# Altium schematic sheet 07_DDR3.SchDoc
size A3; Engineer: Mehmet Selcuk Yayan; Organization: Procenne
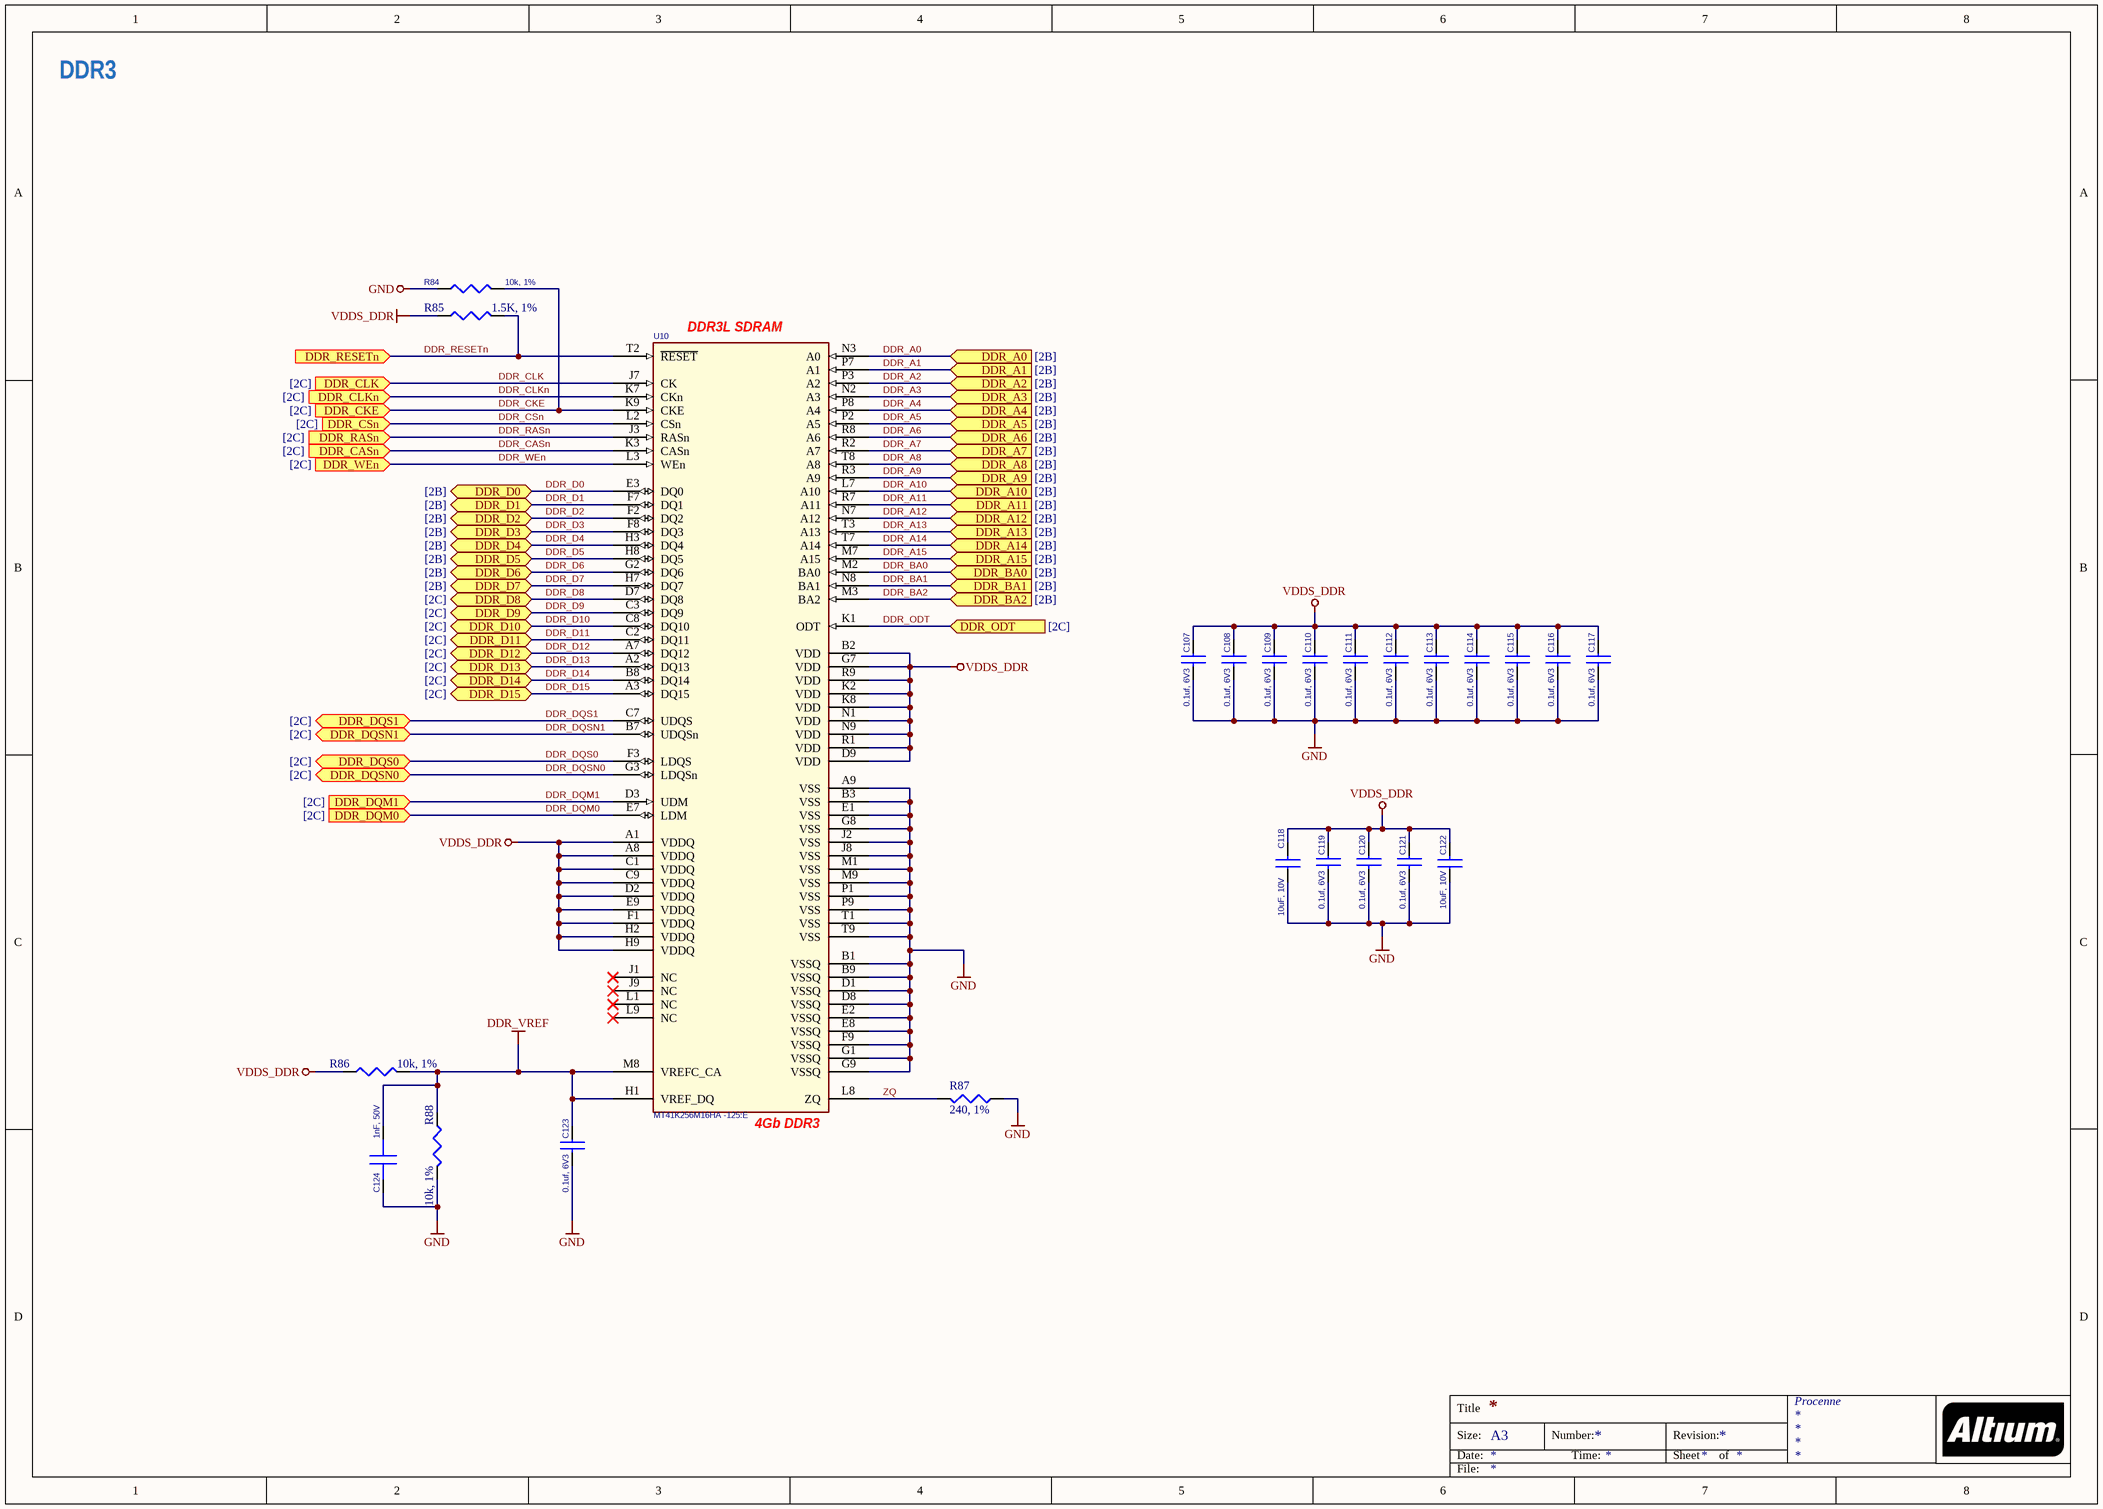
[diagram p0: 07_DDR3.SchDoc]

## Parts
C107  0.1uf, 6V3  [402]
C108  0.1uf, 6V3  [402]
C109  0.1uf, 6V3  [402]
C110  0.1uf, 6V3  [402]
C111  0.1uf, 6V3  [402]
C112  0.1uf, 6V3  [402]
C113  0.1uf, 6V3  [402]
C114  0.1uf, 6V3  [402]
C115  0.1uf, 6V3  [402]
C116  0.1uf, 6V3  [402]
C117  0.1uf, 6V3  [402]
C118  10uF, 10V  [805]
C119  0.1uf, 6V3  [402]
C120  0.1uf, 6V3  [402]
C121  0.1uf, 6V3  [402]
C122  10uF, 10V  [805]
C123  0.1uf, 6V3  [402]
C124  1nF, 50V  [402]
R84  10k, 1%  [402]
R85  1.5K, 1%  [402]
R86  10k, 1%  [402]
R87  240, 1%  [402]
R88  10k, 1%  [402]
U10  MT41K256M16HA -125:E  [BGA96_T9_P8_9X14]

## Ports
DDR_A0 (in, see [2B]), DDR_A1 (in, see [2B]), DDR_A2 (in, see [2B]), DDR_A3 (in, see [2B]), DDR_A4 (in, see [2B]), DDR_A5 (in, see [2B]), DDR_A6 (in, see [2B]), DDR_A7 (in, see [2B]), DDR_A8 (in, see [2B]), DDR_A9 (in, see [2B]), DDR_A10 (in, see [2B]), DDR_A11 (in, see [2B]), DDR_A12 (in, see [2B]), DDR_A13 (in, see [2B]), DDR_A14 (in, see [2B]), DDR_A15 (in, see [2B]), DDR_BA0 (in, see [2B]), DDR_BA1 (in, see [2B]), DDR_BA2 (in, see [2B]), DDR_CASn (in, see [2C]), DDR_CKE (in, see [2C]), DDR_CLK (in, see [2C]), DDR_CLKn (in, see [2C]), DDR_CSn (in, see [2C]), DDR_D0 (bidir, see [2B]), DDR_D1 (bidir, see [2B]), DDR_D2 (bidir, see [2B]), DDR_D3 (bidir, see [2B]), DDR_D4 (bidir, see [2B]), DDR_D5 (bidir, see [2B]), DDR_D6 (bidir, see [2B]), DDR_D7 (bidir, see [2B]), DDR_D8 (bidir, see [2C]), DDR_D9 (bidir, see [2C]), DDR_D10 (bidir, see [2C]), DDR_D11 (bidir, see [2C]), DDR_D12 (bidir, see [2C]), DDR_D13 (bidir, see [2C]), DDR_D14 (bidir, see [2C]), DDR_D15 (bidir, see [2C]), DDR_DQM0 (in, see [2C]), DDR_DQM1 (in, see [2C]), DDR_DQS0 (bidir, see [2C]), DDR_DQS1 (bidir, see [2C]), DDR_DQSN0 (bidir, see [2C]), DDR_DQSN1 (bidir, see [2C]), DDR_ODT (in, see [2C]), DDR_RASn (in, see [2C]), DDR_RESETn (in), DDR_WEn (in, see [2C])

## Nets
DDR_VREF: C123.1 C124.1 R86.2 R88.1 U10.H1(VREF_DQ) U10.M8(VREFC_CA)
GND: C107.2 C108.2 C109.2 C110.2 C111.2 C112.2 C113.2 C114.2 C115.2 C116.2 C117.2 C118.1 C119.2 C120.2 C121.2 C122.1 C123.2 C124.2 R84.1 R87.1 R88.2 U10.A9(VSS) U10.B1(VSSQ) U10.B3(VSS) U10.B9(VSSQ) U10.D1(VSSQ) U10.D8(VSSQ) U10.E1(VSS) U10.E2(VSSQ) U10.E8(VSSQ) U10.F9(VSSQ) U10.G1(VSSQ) U10.G8(VSS) U10.G9(VSSQ) U10.J2(VSS) U10.J8(VSS) U10.M1(VSS) U10.M9(VSS) U10.P1(VSS) U10.P9(VSS) U10.T1(VSS) U10.T9(VSS)
VDDS_DDR: C107.1 C108.1 C109.1 C110.1 C111.1 C112.1 C113.1 C114.1 C115.1 C116.1 C117.1 C118.2 C119.1 C120.1 C121.1 C122.2 R85.1 R86.1 U10.A1(VDDQ) U10.A8(VDDQ) U10.B2(VDD) U10.C1(VDDQ) U10.C9(VDDQ) U10.D2(VDDQ) U10.D9(VDD) U10.E9(VDDQ) U10.F1(VDDQ) U10.G7(VDD) U10.H2(VDDQ) U10.H9(VDDQ) U10.K2(VDD) U10.K8(VDD) U10.N1(VDD) U10.N9(VDD) U10.R1(VDD) U10.R9(VDD)
DDR_A0: U10.N3(A0) ; port DDR_A0
DDR_A1: U10.P7(A1) ; port DDR_A1
DDR_A2: U10.P3(A2) ; port DDR_A2
DDR_A3: U10.N2(A3) ; port DDR_A3
DDR_A4: U10.P8(A4) ; port DDR_A4
DDR_A5: U10.P2(A5) ; port DDR_A5
DDR_A6: U10.R8(A6) ; port DDR_A6
DDR_A7: U10.R2(A7) ; port DDR_A7
DDR_A8: U10.T8(A8) ; port DDR_A8
DDR_A9: U10.R3(A9) ; port DDR_A9
DDR_A10: U10.L7(A10) ; port DDR_A10
DDR_A11: U10.R7(A11) ; port DDR_A11
DDR_A12: U10.N7(A12) ; port DDR_A12
DDR_A13: U10.T3(A13) ; port DDR_A13
DDR_A14: U10.T7(A14) ; port DDR_A14
DDR_A15: U10.M7(A15) ; port DDR_A15
DDR_BA0: U10.M2(BA0) ; port DDR_BA0
DDR_BA1: U10.N8(BA1) ; port DDR_BA1
DDR_BA2: U10.M3(BA2) ; port DDR_BA2
DDR_CASn: U10.K3(CASn) ; port DDR_CASn
DDR_CKE: R84.2 U10.K9(CKE) ; port DDR_CKE
DDR_CLK: U10.J7(CK) ; port DDR_CLK
DDR_CLKn: U10.K7(CKn) ; port DDR_CLKn
DDR_CSn: U10.L2(CSn) ; port DDR_CSn
DDR_D0: U10.E3(DQ0) ; port DDR_D0
DDR_D1: U10.F7(DQ1) ; port DDR_D1
DDR_D2: U10.F2(DQ2) ; port DDR_D2
DDR_D3: U10.F8(DQ3) ; port DDR_D3
DDR_D4: U10.H3(DQ4) ; port DDR_D4
DDR_D5: U10.H8(DQ5) ; port DDR_D5
DDR_D6: U10.G2(DQ6) ; port DDR_D6
DDR_D7: U10.H7(DQ7) ; port DDR_D7
DDR_D8: U10.D7(DQ8) ; port DDR_D8
DDR_D9: U10.C3(DQ9) ; port DDR_D9
DDR_D10: U10.C8(DQ10) ; port DDR_D10
DDR_D11: U10.C2(DQ11) ; port DDR_D11
DDR_D12: U10.A7(DQ12) ; port DDR_D12
DDR_D13: U10.A2(DQ13) ; port DDR_D13
DDR_D14: U10.B8(DQ14) ; port DDR_D14
DDR_D15: U10.A3(DQ15) ; port DDR_D15
DDR_DQM0: U10.E7(LDM) ; port DDR_DQM0
DDR_DQM1: U10.D3(UDM) ; port DDR_DQM1
DDR_DQS0: U10.F3(LDQS) ; port DDR_DQS0
DDR_DQS1: U10.C7(UDQS) ; port DDR_DQS1
DDR_DQSN0: U10.G3(LDQSn) ; port DDR_DQSN0
DDR_DQSN1: U10.B7(UDQSn) ; port DDR_DQSN1
DDR_ODT: U10.K1(ODT) ; port DDR_ODT
DDR_RASn: U10.J3(RASn) ; port DDR_RASn
DDR_RESETn: R85.2 U10.T2(~{RESET}) ; port DDR_RESETn
DDR_WEn: U10.L3(WEn) ; port DDR_WEn
ZQ: R87.2 U10.L8(ZQ)

Not connected (* = marked no-connect by the designer): U10 J1(NC)* J9(NC)* L1(NC)* L9(NC)*

## Notes on the sheet
- DDR3
- (near U10) DDR3L SDRAM
- (near U10) 4Gb DDR3
- Title
- Size:
- Date:
- A3
- Number:
- Time:
- Revision:
- Sheet
- of
- File:

## Library data of the parts
C107-C117 C119-C121 C123 = CAP_0.01uf_X7R_16V_10%_0402: CAP CER 0.1UF 6.3V 10% X5R 0402; Manufacturer: TDK Corporation; Manufacturer Part Number: C1005X5R0J104K050BA; Capacitance: 0.1µF; Supplier 1: Digi-Key; Supplier Part Number 1: 445-1266-6-ND; RoHS: RoHS Compliant; Category: Capacitors; Stock 1: 127604; Pricing 1: 1=0.1, 10=0.026, 100=0.0121, 250=0.00992, 500=0.00848, 1000=0.0066, 5000=0.0055 (USD); Voltage - Rated: 6.3V; Tolerance: ±10%; Temperature Coefficient: X5R; Mounting Type: Surface Mount, MLCC; Operating Temperature: -55°C ~ 85°C; Applications: General Purpose; Ratings: -; Package / Case: 0402 (1005 Metric); Size / Dimension: 0.039" L x 0.020" W (1.00mm x 0.50mm); Height - Seated (Max): -; Thickness (Max): 0.022" (0.55mm); Lead Spacing: -; Features: -; Packaging: Digi-Reel®; Lead Style: -; ComponentLink1URL: http://www.kemet.com/datasheets&C0402C104K4RACTU; ComponentLink1Description: http://www.kemet.com/datasheets&C0402C104K4RACTU
C118 C122 = CAP_4.7uF_X5R_6.3V_10%_0603: CAP CER 10UF 10V Y5V 0805; Manufacturer: TDK Corporation; Manufacturer Part Number: C2012Y5V1A106Z; Capacitance: 10µF; Tolerance: -20%, +80%; Temperature Coefficient: Y5V (F); Supplier 1: Digi-Key; Supplier Part Number 1: 445-1371-6-ND; RoHS: RoHS Compliant; Category: Capacitors; Stock 1: 102071; Pricing 1: 1=0.15, 10=0.105, 100=0.0499, 250=0.042, 500=0.03518, 1000=0.02887 (USD); Voltage - Rated: 10V; Mounting Type: Surface Mount, MLCC; Operating Temperature: -30°C ~ 85°C; Applications: General Purpose; Ratings: -; Package / Case: 0805 (2012 Metric); Size / Dimension: 0.079" L x 0.049" W (2.00mm x 1.25mm); Height - Seated (Max): -; Thickness (Max): 0.057" (1.45mm); Lead Spacing: -; Features: -; Packaging: Digi-Reel®; Lead Style: -; ComponentLink1URL: http://media.digikey.com/pdf/Data%20Sheets/TDK%20PDFs/C_Series_GeneralAppl_B11.pdf; ComponentLink1Description: http://media.digikey.com/pdf/Data%20Sheets/TDK%20PDFs/C_Series_GeneralAppl_B11.pdf
C124 = CAP SMD: CAP CER 1000PF 16V 10% X7R 0402; Manufacturer: Yageo; Manufacturer Part Number: CC0402KRX7R7BB102; Supplier 1: Digi-Key; Supplier Part Number 1: 311-1352-6-ND; RoHS: RoHS Compliant; Category: Capacitors; Stock 1: 391222; Pricing 1: 1=0.1, 10=0.012, 25=0.0088, 100=0.0057, 250=0.00464, 500=0.00396, 1000=0.00309, 2500=0.00278, 5000=0.00258 (USD); Capacitance: 1000pF; Voltage - Rated: 16V; Tolerance: ±10%; Temperature Coefficient: X7R; Mounting Type: Surface Mount, MLCC; Operating Temperature: -55°C ~ 125°C; Applications: General Purpose; Ratings: -; Package / Case: 0402 (1005 Metric); Size / Dimension: 0.039" L x 0.020" W (1.00mm x 0.50mm); Height - Seated (Max): -; Thickness (Max): 0.022" (0.55mm); Lead Spacing: -; Features: -; Packaging: Digi-Reel®; Lead Style: -; ComponentLink1URL: http://www.yageo.com/documents/recent/UPY-GPHC_X7R_6.3V-to-50V_8.pdf; ComponentLink1Description: http://www.yageo.com/documents/recent/UPY-GPHC_X7R_6.3V-to-50V_8.pdf
R84 R86 R88 = RES_10K_1/16W_1%_0402: RES 10K OHM 1/16W 5% 0402 SMD; Manufacturer: Rohm Semiconductor; Manufacturer Part Number: MCR01MZPJ103; Power (Watts): 0.063W, 1/16W; Temperature Coefficient: ±200ppm/°C; Category: Resistors; ComponentLink1Description: http://rohmfs.rohm.com/en/products/databook/datasheet/passive/resistor/chip_resistor/mcr_a.pdf; ComponentLink1URL: http://rohmfs.rohm.com/en/products/databook/datasheet/passive/resistor/chip_resistor/mcr_a.pdf; Composition: Thick Film; Features: Automotive AEC-Q200 Qualified; Height: 0.016" (0.40mm); Number of Terminations: 2; Package / Case: 0402 (1005 Metric); Packaging: Digi-Reel®; Pricing 1: 1=0.1, 10=0.019, 25=0.014, 100=0.0078, 250=0.00596, 500=0.00476, 1000=0.0035, 5000=0.00251 (USD); Resistance (Ohms): 10k; RoHS: RoHS Compliant; Size / Dimension: 0.039" L x 0.020" W (1.00mm x 0.50mm); Stock 1: 110842; Supplier 1: Digi-Key; Supplier Device Package: 0402 (1005 Metric); Supplier Part Number 1: RHM10KJDKR-ND; Tolerance: ±5%
R85 = RES_10K_1/16W_1%_0402: RES 1.50K OHM 1/16W 1% 0402 SMD; Manufacturer: Yageo; Manufacturer Part Number: RC0402FR-071K5L; Power (Watts): 0.063W, 1/16W; Temperature Coefficient: ±100ppm/°C; Supplier 1: Digi-Key; Supplier Part Number 1: 311-1.50KLRDKR-ND; RoHS: RoHS Compliant; Category: Resistors; Stock 1: 433921; Pricing 1: 1=0.1, 10=0.014, 25=0.0104, 100=0.0063, 250=0.0054, 500=0.00382, 1000=0.0027, 2500=0.00234, 5000=0.00203 (USD); Resistance (Ohms): 1.5k; Composition: Thick Film; Features: -; Tolerance: ±1%; Package / Case: 0402 (1005 Metric); Supplier Device Package: 0402; Size / Dimension: 0.039" L x 0.020" W (1.00mm x 0.50mm); Height: 0.016" (0.40mm); Number of Terminations: 2; Packaging: Digi-Reel®; ComponentLink1URL: http://www.yageo.com/documents/recent/PYu-RC0402_51_RoHS_L_6.pdf; ComponentLink1Description: http://www.yageo.com/documents/recent/PYu-RC0402_51_RoHS_L_6.pdf
R87 = RES_10K_1/16W_1%_0402: RES 240 OHM 1/10W 5% 0402 SMD; Manufacturer: Yageo; Manufacturer Part Number: RC0402FR-07240RL; Resistance (Ohms): 240; Power (Watts): 0.063W, 1/16W; Temperature Coefficient: ±100ppm/°C; Supplier 1: Digi-Key; Supplier Part Number 1: 311-240LRDKR-ND; RoHS: RoHS Compliant; Category: Resistors; Stock 1: 39100; Pricing 1: 1=0.1, 10=0.014, 25=0.0104, 100=0.0063, 250=0.0054, 500=0.00382, 1000=0.0027, 2500=0.00234, 5000=0.00203 (USD); Composition: Thick Film; Features: -; Tolerance: ±1%; Package / Case: 0402 (1005 Metric); Supplier Device Package: 0402; Size / Dimension: 0.039" L x 0.020" W (1.00mm x 0.50mm); Height: 0.016" (0.40mm); Number of Terminations: 2; Packaging: Digi-Reel®; ComponentLink1URL: http://www.yageo.com/documents/recent/PYu-RC0402_51_RoHS_L_6.pdf; ComponentLink1Description: http://www.yageo.com/documents/recent/PYu-RC0402_51_RoHS_L_6.pdf
U10 = MT41K256M16HA: DDR2 SDRAM 2Gb (256Mx8); Manufacturer: Micron Technology; Lead Time: 0 weeks; Peak Solder Temperature: 260 deg C; Supplier 1: Arrow; Supplier Part Number 1: 52128708S9959891N2406; Manufacturer Part Number: MT41K256M16HA-125:E; RoHS: CHINA ROHS: Compliant / EU ROHS: Compliant; Stock 1: 0; Pricing 1: 0=10.09 (USD); Package Quantity: 1; Termination Finish: Sn/Ag/Cu; China ROHS Lead (X -> above / O -> below threshold): O; China ROHS Mercury (X -> above / O -> below threshold): O; China ROHS Cadmium (X -> above / O -> below threshold): O; China ROHS Hex Chromium (X -> above / O -> below threshold): O; China ROHS PBB (X -> above / O -> below threshold): O; China ROHS PBDE (X -> above / O -> below threshold): O; EU_ROHS_PROD_EXEMPTION_BY_SUPP: N/R; ComponentLink1URL: http://components.arrow.com/partservice/dataview/altium/52128708S9959891N2406?apiKey=aa438727d59eed98c4bed826d8d949c84cb5e685b92bf87346a0226bd2658797; ComponentLink1Description: http://components.arrow.com/partservice/dataview/altium/52128708S9959891N2406?apiKey=aa438727d59eed98c4bed826d8d949c84cb5e685b92bf87346a0226bd2658797